# EAGLE schematic untitled (EAGLE 6.4)
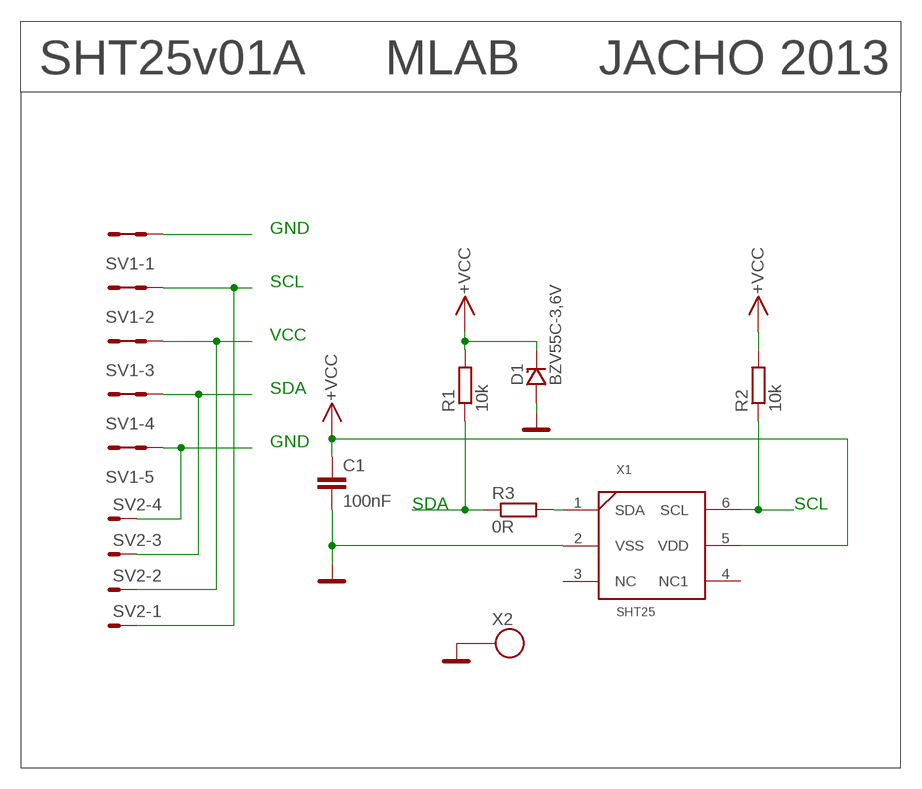
[diagram p0: schematic, sheet 1]

## Parts
C1  100nF  C-EUC0805  [C0805]
D1  BZV55C-3,6V  D-ZENEROVA  [MINIMELF]
R1  10k  R-EU_R0805  [R0805]
R2  10k  R-EU_R0805  [R0805]
R3  0R  R-EU_R0805  [R0805]
SV1  MA05-2  [MA05-2]
SV2  SMD_MA04-01  [SMD_MA04-1]
X1  SHT25  [SHT25]
X2  SROUB3M  [SROUB3M]

## Nets
GND: C1.2 D1.A SV1.1 SV1.2 SV1.9 SV1.10 SV2.4 X1.2(VSS) X2.P$1
N$2: R3.2 X1.1(SDA)
SCL: R2.1 SV1.3 SV1.4 SV2.1 X1.6(SCL)
SDA: R1.1 R3.1 SV1.7 SV1.8 SV2.3
VCC: C1.1 D1.C(K) R1.2 R2.2 SV1.5 SV1.6 SV2.2 X1.5(VDD) ; supply symbol labelled +VCC
Unconnected: X1.3(NC) X1.4(NC1)

## Notes on the sheet
- SHT25v01A | MLAB | JACHO 2013
- GND
- SCL
- VCC
- SDA
- GND
- SDA | SCL

## Library data of the parts
C1 = rcl:C-EU: CAPACITOR, European symbol
D1 = moje_diody:D-ZENEROVA
R1-R3 = rcl:R-EU_: RESISTOR, European symbol
SV1 = moje_hrebinky:MA05-2: PIN HEADER; OC_FARNELL: unknown; OC_NEWARK: unknown
SV2 = moje_hrebinky:SMD_MA04-01
X1 = moje_cidla:SHT25
X2 = moje:SROUB3M